# EAGLE design Wrigley V1 (EAGLE 9.6.2)
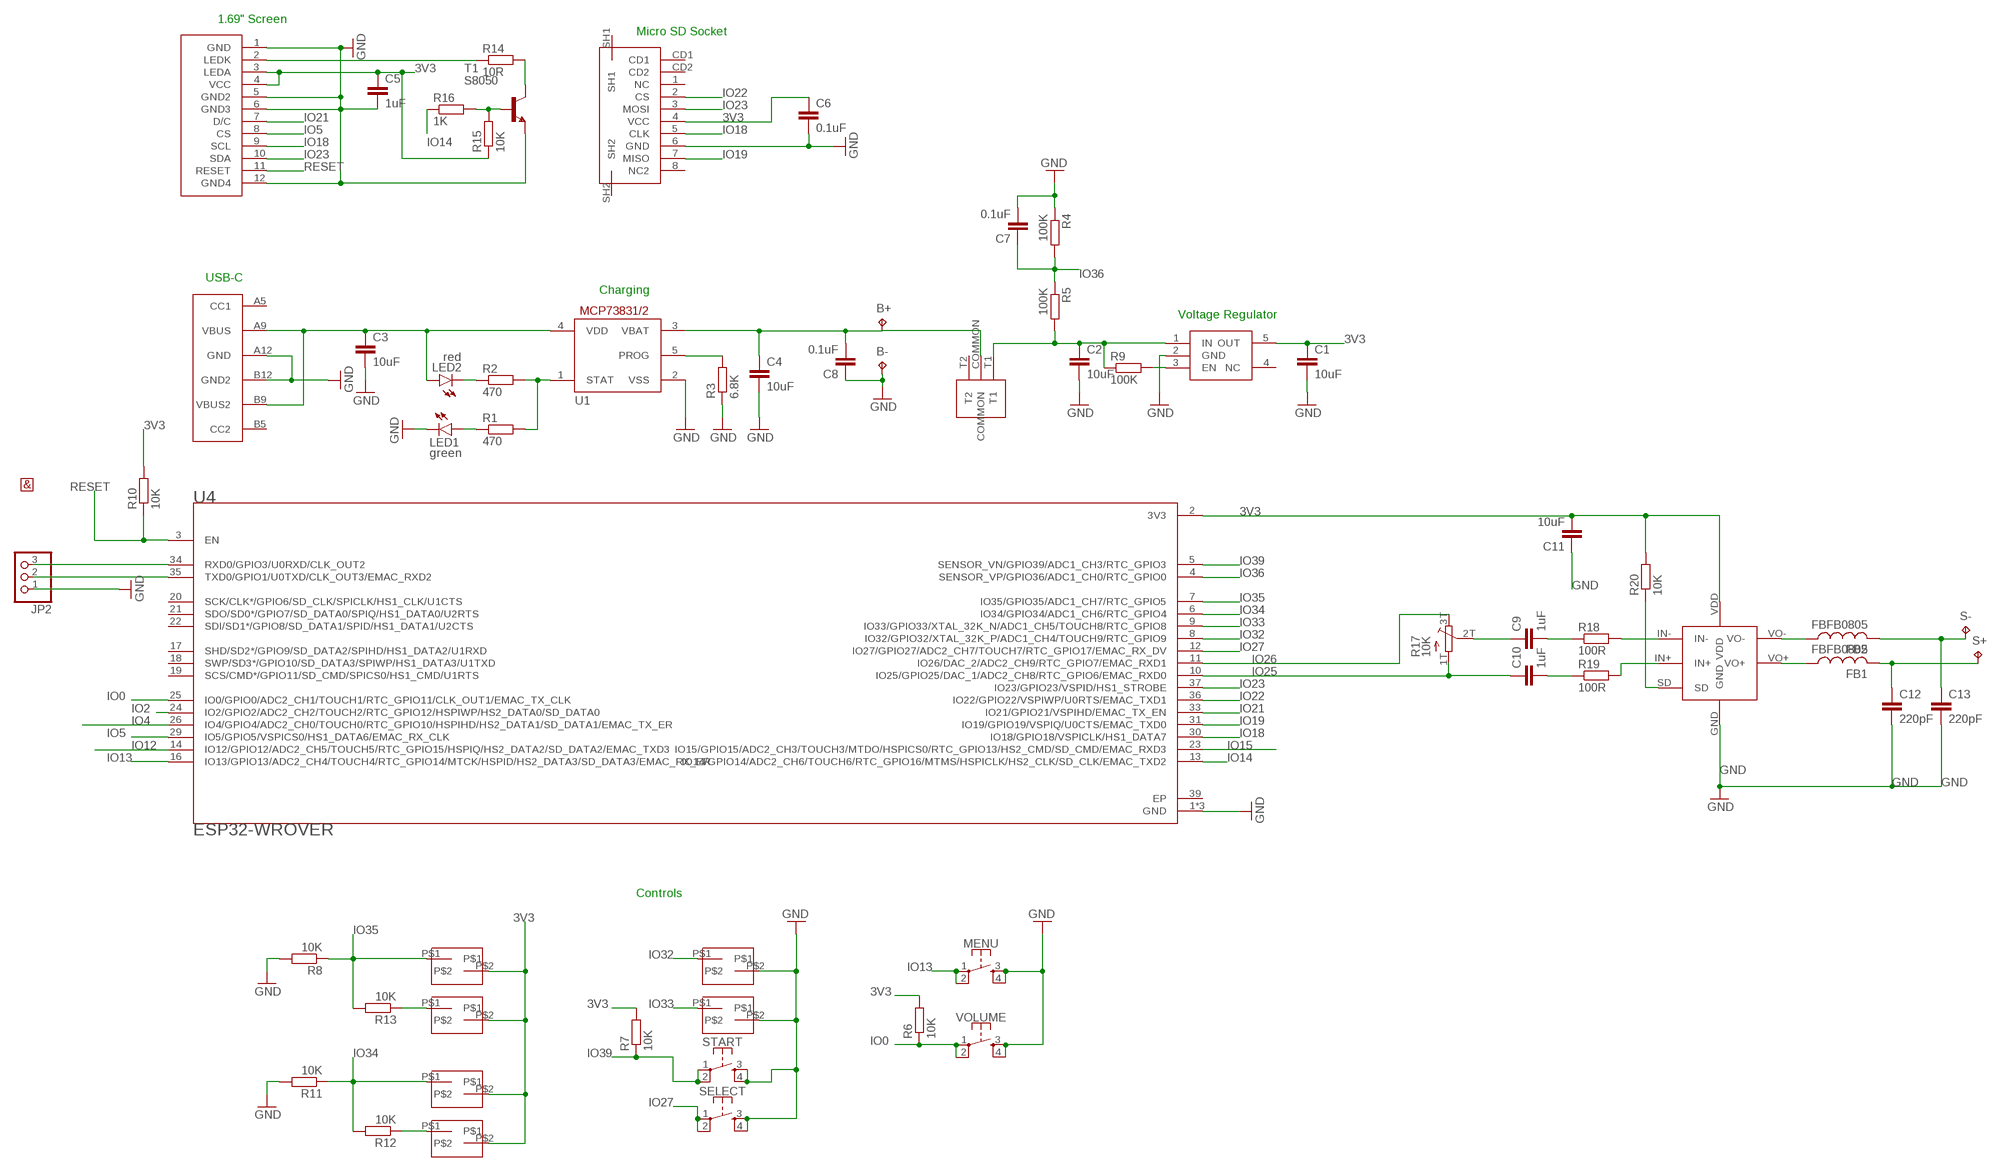
[diagram p0: schematic, sheet 1]

## Parts
A  POCKET-BUTTONS-BIG  [POCKET-MEMBRANE-BIG]
B  POCKET-BUTTONS-BIG  [POCKET-MEMBRANE-BIG]
B+  TPTP20R  [TP20R]
B-  TPTP20R  [TP20R]
C1  10uF  C-EUC0805  [C0805]
C2  10uF  C-EUC0805  [C0805]
C3  10uF  C-EUC0805  [C0805]
C4  10uF  C-EUC0805  [C0805]
C5  1uF  C-EUC0805  [C0805]
C6  0.1uF  C-EUC0805  [C0805]
C7  0.1uF  C-EUC0805  [C0805]
C8  0.1uF  C-EUC0805  [C0805]
C9  1uF  C-EUC0805  [C0805]
C10  1uF  C-EUC0805  [C0805]
C11  10uF  C-EUC0805  [C0805]
C12  220pF  C-EUC0805  [C0805]
C13  220pF  C-EUC0805  [C0805]
DOWN  POCKET-BUTTONS-BIG  [POCKET-MEMBRANE-BIG]
FB1  FBFB0805  [0805]
FB2  FBFB0805  [0805]
JP2  PINHD-1X03_2.54-S  [1X03-S]
LED1  green  LEDCHIP-LED0805  [CHIP-LED0805]
LED2  red  LEDCHIP-LED0805  [CHIP-LED0805]
LEFT  POCKET-BUTTONS-BIG  [POCKET-MEMBRANE-BIG]
MENU  MOMENTARY-SWITCH-SPST-2-SMD-5.2MM  [TACTILE_SWITCH_SMD_5.2MM]
R1  470  R-EU_R0805  [R0805]
R2  470  R-EU_R0805  [R0805]
R3  6.8K  R-EU_R0805  [R0805]
R4  100K  R-EU_M0805  [M0805]
R5  100K  R-EU_M0805  [M0805]
R6  10K  R-EU_M0805  [M0805]
R7  10K  R-EU_M0805  [M0805]
R8  10K  R-EU_M0805  [M0805]
R9  100K  R-EU_M0805  [M0805]
R10  10K  R-EU_M0805  [M0805]
R11  10K  R-EU_M0805  [M0805]
R12  10K  R-EU_M0805  [M0805]
R13  10K  R-EU_M0805  [M0805]
R14  10R  R-EU_M0805  [M0805]
R15  10K  R-EU_M0805  [M0805]
R16  1K  R-EU_M0805  [M0805]
R17  10K  TRIMPOT  [SLIDE-POT-RS08U11AZ001]
R18  100R  R-EU_R0805  [R0805]
R19  100R  R-EU_R0805  [R0805]
R20  10K  R-EU_R0805  [R0805]
RIGHT  POCKET-BUTTONS-BIG  [POCKET-MEMBRANE-BIG]
S+  TPTP20R  [TP20R]
S-  TPTP20R  [TP20R]
SELECT  MOMENTARY-SWITCH-SPST-2-SMD-5.2MM  [TACTILE_SWITCH_SMD_5.2MM]
START  MOMENTARY-SWITCH-SPST-2-SMD-5.2MM  [TACTILE_SWITCH_SMD_5.2MM]
T1  S8050  [SOT23-BEC]
U1  MCP73831/OT  [SOT23-5L]
U2  AP2112-REGULATORWRIGLEY  [SOT23-5L]
U3  PAM8302A  [PAM8302A-SOP8]
U4  ESP32-WROVER  [XCVR-ESP32-WROVER]
U$1  MICROSD-SOCKET-RISTRETTONO-HOLES  [MICROSD-SOCKET-WRIGLEY]
U$3  1.69-INCH-SCREEN-ROUNDED  [1.69-INCH-SCREEN-ROUNDED]
U$5  NULL2-SWITCH  [NULL2-SWITCH]
U$8  USB-C-6PIN  [USB-C-6PIN]
U$9  AMP-HALF  [AMP-HALF]
UP  POCKET-BUTTONS-BIG  [POCKET-MEMBRANE-BIG]
VOLUME  MOMENTARY-SWITCH-SPST-2-SMD-5.2MM  [TACTILE_SWITCH_SMD_5.2MM]

## Nets
3V3: C1.1 C5.1 C6.1 C11.2 DOWN.P$2 LEFT.P$2 R6.2 R7.2 R10.2 R15.1 R20.2 RIGHT.P$2 U2.5(OUT) U3.VDD U4.2(3V3) U$1.4(VCC) U$3.3(LEDA) U$3.4(VCC) UP.P$2
GND: A.P$2 B-.TP B.P$2 C1.2 C2.2 C3.2 C4.2 C5.2 C6.2 C7.2 C8.1 C11.1 C12.2 C13.2 JP2.1 LED1.C MENU.3 MENU.4 R3.1 R4.1 R8.2 R11.2 SELECT.3 SELECT.4 START.3 START.4 T1.E U1.2(VSS) U2.2(GND) U3.GND U4.1(GND) U4.15(GND) U4.38(GND) U$1.6(GND) U$3.1(GND) U$3.5(GND2) U$3.6(GND3) U$3.12(GND4) U$8.A12(GND) U$8.B12(GND2) VOLUME.3 VOLUME.4
IO0: R6.1 U4.25(IO0/GPIO0/ADC2_CH1/TOUCH1/RTC_GPIO11/CLK_OUT1/EMAC_TX_CLK) VOLUME.1 VOLUME.2
IO2: U4.24(IO2/GPIO2/ADC2_CH2/TOUCH2/RTC_GPIO12/HSPIWP/HS2_DATA0/SD_DATA0)
IO4: U4.26(IO4/GPIO4/ADC2_CH0/TOUCH0/RTC_GPIO10/HSPIHD/HS2_DATA1/SD_DATA1/EMAC_TX_ER)
IO5: U4.29(IO5/GPIO5/VSPICS0/HS1_DATA6/EMAC_RX_CLK) U$3.8(CS)
IO12: U4.14(IO12/GPIO12/ADC2_CH5/TOUCH5/RTC_GPIO15/HSPIQ/HS2_DATA2/SD_DATA2/EMAC_TXD3)
IO13: MENU.1 MENU.2 U4.16(IO13/GPIO13/ADC2_CH4/TOUCH4/RTC_GPIO14/MTCK/HSPID/HS2_DATA3/SD_DATA3/EMAC_RX_ER)
IO14: R16.1 U4.13(IO14/GPIO14/ADC2_CH6/TOUCH6/RTC_GPIO16/MTMS/HSPICLK/HS2_CLK/SD_CLK/EMAC_TXD2)
IO15: U4.23(IO15/GPIO15/ADC2_CH3/TOUCH3/MTDO/HSPICS0/RTC_GPIO13/HS2_CMD/SD_CMD/EMAC_RXD3)
IO18: U4.30(IO18/GPIO18/VSPICLK/HS1_DATA7) U$1.5(CLK) U$3.9(SCL)
IO19: U4.31(IO19/GPIO19/VSPIQ/U0CTS/EMAC_TXD0) U$1.7(MISO)
IO21: U4.33(IO21/GPIO21/VSPIHD/EMAC_TX_EN) U$3.7(D/C)
IO22: U4.36(IO22/GPIO22/VSPIWP/U0RTS/EMAC_TXD1) U$1.2(CS)
IO23: U4.37(IO23/GPIO23/VSPID/HS1_STROBE) U$1.3(MOSI) U$3.10(SDA)
IO25: C10.1 R17.1T U4.10(IO25/GPIO25/DAC_1/ADC2_CH8/RTC_GPIO6/EMAC_RXD0)
IO26: R17.3T U4.11(IO26/DAC_2/ADC2_CH9/RTC_GPIO7/EMAC_RXD1)
IO27: SELECT.1 SELECT.2 U4.12(IO27/GPIO27/ADC2_CH7/TOUCH7/RTC_GPIO17/EMAC_RX_DV)
IO32: A.P$1 U4.8(IO32/GPIO32/XTAL_32K_P/ADC1_CH4/TOUCH9/RTC_GPIO9)
IO33: B.P$1 U4.9(IO33/GPIO33/XTAL_32K_N/ADC1_CH5/TOUCH8/RTC_GPIO8)
IO34: LEFT.P$1 R11.1 R12.2 U4.6(IO34/GPIO34/ADC1_CH6/RTC_GPIO4)
IO35: R8.1 R13.2 U4.7(IO35/GPIO35/ADC1_CH7/RTC_GPIO5) UP.P$1
IO36: C7.1 R4.2 R5.1 U4.4(SENSOR_VP/GPIO36/ADC1_CH0/RTC_GPIO0)
IO39: R7.1 START.1 START.2 U4.5(SENSOR_VN/GPIO39/ADC1_CH3/RTC_GPIO3)
N$1: R9.2 U2.3(EN)
N$2: C2.1 R5.2 R9.1 U2.1(IN) U$5.T1
N$3: R3.2 U1.5(PROG)
N$4: R1.2 R2.2 U1.1(STAT)
N$5: LED2.C R2.1
N$6: LED1.A R1.1
N$7: DOWN.P$1 R13.1
N$8: C3.1 LED2.A U1.4(VDD) U$8.A9(VBUS) U$8.B9(VBUS2)
N$9: B+.TP C4.1 C8.2 U1.3(VBAT) U$5.COMMON
N$10: R14.1 U$3.2(LEDK)
N$11: JP2.3 U4.34(RXD0/GPIO3/U0RXD/CLK_OUT2)
N$12: JP2.2 U4.35(TXD0/GPIO1/U0TXD/CLK_OUT3/EMAC_RXD2)
N$13: R14.2 T1.C
N$14: R15.2 R16.2 T1.B
N$15: R12.1 RIGHT.P$1
N$16: C9.1 R17.2T
N$17: C9.2 R18.1
N$18: C10.2 R19.1
N$19: R18.2 U3.IN-
N$20: R19.2 U3.IN+
N$21: C13.1 FB2.2 S-.TP
N$22: C12.1 FB1.2 S+.TP
N$23: FB2.1 U3.VO-
N$24: FB1.1 U3.VO+
N$25: R20.1 U3.SD
RESET: R10.1 U4.3(EN) U$3.11(RESET)
Unconnected: U2.4(NC) U4.17(SHD/SD2*/GPIO9/SD_DATA2/SPIHD/HS1_DATA2/U1RXD) U4.18(SWP/SD3*/GPIO10/SD_DATA3/SPIWP/HS1_DATA3/U1TXD) U4.19(SCS/CMD*/GPIO11/SD_CMD/SPICS0/HS1_CMD/U1RTS) U4.20(SCK/CLK*/GPIO6/SD_CLK/SPICLK/HS1_CLK/U1CTS) U4.21(SDO/SD0*/GPIO7/SD_DATA0/SPIQ/HS1_DATA0/U2RTS) U4.22(SDI/SD1*/GPIO8/SD_DATA1/SPID/HS1_DATA1/U2CTS) U$1.1(NC) U$1.8(NC2) U$1.CD1 U$1.CD2 U$1.SH1 U$1.SH2 U$5.T2 U$8.A5(CC1) U$8.B5(CC2)

## Notes on the sheet
- 1.69" Screen
- Micro SD Socket
- USB-C
- Charging
- Voltage Regulator
- Controls

## Power pins joined to a net without a drawn wire
EP: U4.39(EP)

## Library data of the parts
A B DOWN LEFT RIGHT UP = Ristretto:POCKET-BUTTONS-BIG
B+ B- S+ S- = testpad:TP: Test pad
C1-C13 = rcl:C-EU: CAPACITOR, European symbol; SPICEPREFIX: C
FB1 FB2 = Ristretto:FB: Ferrite bead Digikey #P9821BK-ND
JP2 = Ristretto:PINHD-1X03: PIN HEADER
LED1 LED2 = led:LED: LED OSRAM: - CHIPLED LG R971, LG N971, LY N971, LG Q971, LY Q971, LO R971, LY R971 LH N974, LH R974 LS Q976, LO Q976, LY Q976 LO Q996 - Hyper CHIPLED LW Q18S LB Q993, LB Q99A, LB R99A - SideLED LS A670, LO A670, LY A670, LG A670, LP A670 LB A673, LV A673, LT A673, LW A673 LH A674 LY A675 LS A676, LA A676, LO A676, LY A676, LW A676 LS A679, LY A679, LG A679 - Hyper Micro SIDELED® LS Y876, LA Y876, LO Y876, LY Y876 LT Y87S - SmartLED LW L88C, LW L88S LB L89C, LB L89S, LG L890 LS L89K, LO L89K, LY L89K LS L896, LA L896, LO L896, LY L896 - TOPLED LS T670, LO T670, LY T670, LG T670, LP T670 LSG T670, LSP T670, LSY T670, LOP T670, LYG T670 LG T671, LOG T671, LSG T671 LB T673, LV T673, LT T673, LW T673 LH T674 LS T676, LA T676, LO T676, LY T676, LB T676, LH T676, LSB T676, LW T676 LB T67C, LV T67C, LT T67C, LS T67K, LO T67K, LY T67K, LW E67C LS E67B, LA E67B, LO E67B, LY E67B, LB E67C, LV E67C, LT E67C LW T67C LS T679, LY T679, LG T679 LS T770, LO T770, LY T770, LG T770, LP T770 LB T773, LV T773, LT T773, LW T773 LH T774 LS E675, LA E675, LY E675, LS T675 LS T776, LA T776, LO T776, LY T776, LB T776 LHGB T686 LT T68C, LB T68C - Hyper Mini TOPLED® LB M676 - Mini TOPLED Santana® LG M470 LS M47K, LO M47K, LY M47K Source: http://www.osram.convergy.de LUXEON: - LUMILED® LXK2-PW12-R00, LXK2-PW12-S00, LXK2-PW14-U00, LXK2-PW14-V00 LXK2-PM12-R00, LXK2-PM12-S00, LXK2-PM14-U00 LXK2-PE12-Q00, LXK2-PE12-R00, LXK2-PE12-S00, LXK2-PE14-T00, LXK2-PE14-U00 LXK2-PB12-K00, LXK2-PB12-L00, LXK2-PB12-M00, LXK2-PB14-N00, LXK2-PB14-P00, LXK2-PB14-Q00 LXK2-PR12-L00, LXK2-PR12-M00, LXK2-PR14-Q00, LXK2-PR14-R00 LXK2-PD12-Q00, LXK2-PD12-R00, LXK2-PD12-S00 LXK2-PH12-R00, LXK2-PH12-S00 LXK2-PL12-P00, LXK2-PL12-Q00, LXK2-PL12-R00 Source: www.luxeon.com KINGBRIGHT: KA-3528ASYC Source: www.kingbright.com
MENU SELECT START VOLUME = Ristretto:MOMENTARY-SWITCH-SPST-2: Momentary Switch (Pushbutton) - SPST - Two Circuits Normally-open (NO) SPST momentary switches (buttons, pushbuttons). Schematic symbol includes two switch circuits. Variants SMD-4.6MMX2.8MM - 4.60mm x 2.80mm Tactile Momentary Button Switch - Used on SparkFun SAMD21 Mini Breakout <https://www.sparkfun.com/products/13664> SMD-5.2MM - Mini Pushbutton Switch - SMD <https://www.sparkfun.com/products/8720> - Used on Arduino Pro Mini <https://www.sparkfun.com/products/11114>; PROD_ID: SWCH-08247; SF_SKU: COM-08720
R1-R16 = resistor:R-EU_: RESISTOR, European symbol
R17 = Ristretto:TRIMPOT: SMT trimmer potentiometer part number TC33X http://www.ladyada.net/library/eagle
R18-R20 = rcl:R-EU_: RESISTOR, European symbol; SPICEPREFIX: R
T1 = Ristretto:S8050
U1 = adafruit:MCP73831: MCP73831/2 Miniature Single-Cell, Fully Integrated Li-Ion, Li-Polymer Charge Management Controllers. Nice and small simple lipoly charge controller, with adjustable current and status output (LED) http://www.ladyada.net/library/pcb/eaglelibrary.html
U2 = Ristretto:AP2112-REGULATOR
U3 = Ristretto:PAM8302A
U4 = Ristretto:ESP32-WROVER
U$1 = Ristretto:MICROSD-SOCKET-RISTRETTO
U$3 = Ristretto:1.69-INCH-SCREEN-ROUNDED
U$5 = Ristretto:NULL2-SWITCH
U$8 = ESPkachu:USB-C-6PIN
U$9 = Ristretto:AMP-HALF

## Board
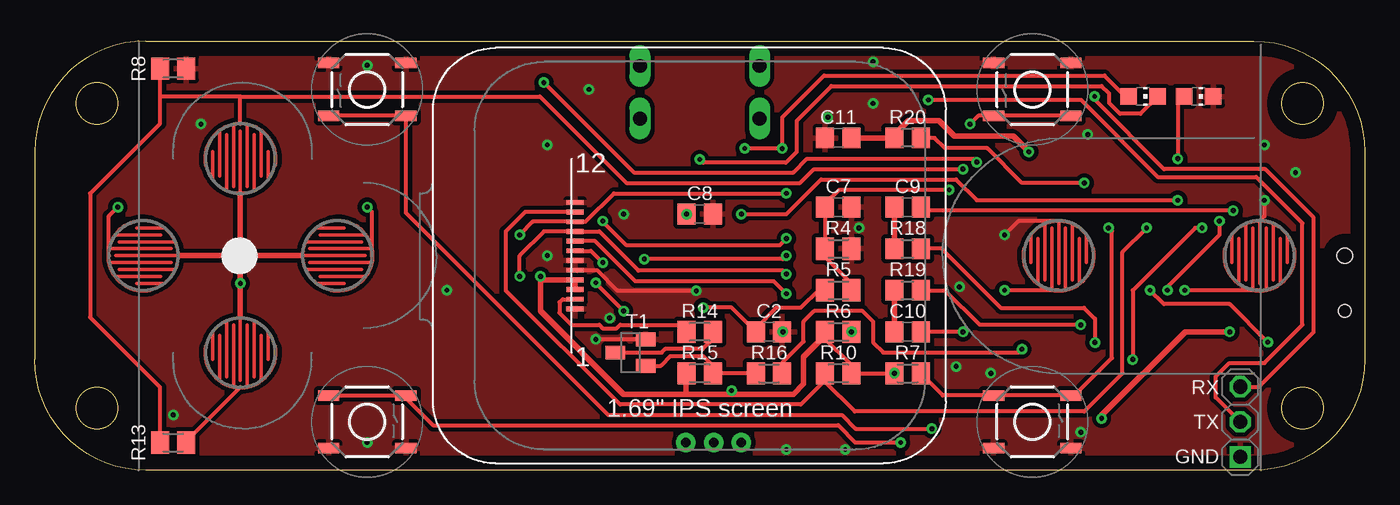
[diagram p1: board, top side]
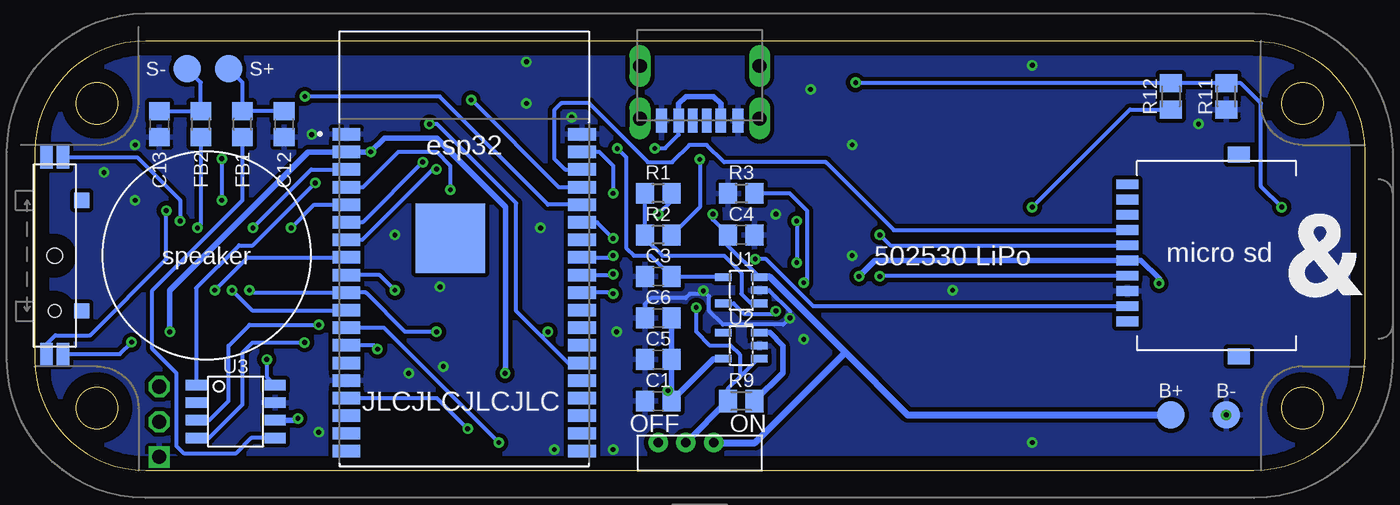
[diagram p2: board, bottom side, seen from below]

Size 96 x 31 mm. Coordinates in mm from the lower left corner, seen from the top.
Outline: 8,31 88,31 arc-90 96,23 96,8 arc-90 88,0 8,0 arc-90 0,8 0,23 arc-90 8,31
Outline: circle at 4.5,4.5 radius 1.5
Outline: circle at 91.5,26.5 radius 1.5
Outline: circle at 4.5,26.5 radius 1.5
Outline: circle at 91.5,4.5 radius 1.5
Copper layers (1*16): Top 0.035mm / dielectric 1.5mm / Bottom 0.035mm
Design rules "default": minimum track width 6mil, minimum drill 0.35mm, track to track 6mil, track to pad 6mil, pad to pad 6mil, via to via 6mil, smd to smd 6mil, copper to edge 40mil, drill to drill 6mil, minimum pad ring 10mil, minimum via ring 8mil, stop-mask expansion 4mil, vias tented up to drill 0mil, thermal gap 10mil

### Footprints (pad centres in the part's own frame; a part is rotated, then mirrored left to right if it is on the bottom)
POCKET-MEMBRANE-BIG = smd 0.305 x 0.152: P$1 0,2.5; P$2 0,-2.5
TP20R = smd 2 x 2: TP 0,0
C0805 = smd 1.3 x 1.5: 1 -0.95,0; 2 0.95,0
0805 = smd 1.3 x 1.5: 1 -0.95,0; 2 0.95,0
1X03-S = drill 1.016 square: 1 -2.54,0 | drill 1.016 octagon: 2 0,0; 3 2.54,0
CHIP-LED0805 = smd 1.2 x 1.2: A 0,-1.05; C 0,1.05
TACTILE_SWITCH_SMD_5.2MM = smd 1.524 x 0.762: 1 -2.794,1.905; 2 2.794,1.905; 3 -2.794,-1.905; 4 2.794,-1.905
R0805 = smd 1.3 x 1.5: 1 -0.95,0; 2 0.95,0
M0805 = smd 1.3 x 1.6: 1 -0.95,0; 2 0.95,0
SLIDE-POT-RS08U11AZ001 = smd 1.6 x 0.9: 1T -7.1,-0.6; 2T -7.1,0.6; 3T 7.1,-0.6; DUMMY 7.1,0.6 | smd 1.1 x 1.1: SH1 -4,-1.95; SH2 4,-1.95 | hole 1.1: 0,0 | hole 0.9: -4,0
SOT23-BEC = smd 1 x 1.4: B -0.95,-1.1; C 0,1.1; E 0.95,-1.1
SOT23-5L = smd 0.55 x 1.2: 1 -0.95,-1.3; 2 0,-1.3; 3 0.95,-1.3; 4 0.95,1.3; 5 -0.95,1.3
PAM8302A-SOP8 = smd 0.75 x 1.5: GND -0.637,2.85; IN+ 0.637,-2.85; IN- 1.913,-2.85; NC -0.637,-2.85; SD -1.913,-2.85; VDD 0.637,2.85; VO+ 1.913,2.85; VO- -1.913,2.85
XCVR-ESP32-WROVER = smd 2 x 0.9: 1 -8.5,8.26; 2 -8.5,6.99; 3 -8.5,5.72; 4 -8.5,4.45; 5 -8.5,3.18; 6 -8.5,1.91; 7 -8.5,0.64; 8 -8.5,-0.63; 9 -8.5,-1.9; 10 -8.5,-3.17; 11 -8.5,-4.44; 12 -8.5,-5.71; 13 -8.5,-6.98; 14 -8.5,-8.25; 15 -8.5,-9.52; 16 -8.5,-10.79; 17 -8.5,-12.06; 18 -8.5,-13.33; 19 -8.5,-14.6; 20 8.5,-14.6; 21 8.5,-13.33; 22 8.5,-12.06; 23 8.5,-10.79; 24 8.5,-9.52; 25 8.5,-8.25; 26 8.5,-6.98; 27 8.5,-5.71; 28 8.5,-4.44; 29 8.5,-3.17; 30 8.5,-1.9; 31 8.5,-0.63; 32 8.5,0.64; 33 8.5,1.91; 34 8.5,3.18; 35 8.5,4.45; 36 8.5,5.72; 37 8.5,6.99; 38 8.5,8.26 | smd 5 x 5: 39 -1,0.76
MICROSD-SOCKET-WRIGLEY = smd 0.7 x 1.6: 1 -2.95,-3.15; 2 -1.85,-3.15; 3 -0.75,-3.15; 4 0.35,-3.15; 5 1.45,-3.15; 6 2.55,-3.15; 7 3.65,-3.15; 8 4.75,-3.15; CD1 -5.15,-3.15; CD2 -4.05,-3.15 | smd 1.15 x 1.6: SH1 -7.29,4.9; SH2 7.29,4.9
1.69-INCH-SCREEN-ROUNDED = smd 1.2 x 0.35: 1 -9,-3.85; 2 -9,-3.15; 3 -9,-2.45; 4 -9,-1.75; 5 -9,-1.05; 6 -9,-0.35; 7 -9,0.35; 8 -9,1.05; 9 -9,1.75; 10 -9,2.45; 11 -9,3.15; 12 -9,3.85
NULL2-SWITCH = drill 0.7 pad 1.422: COMMON 3.5,0.5; T1 5.5,0.5; T2 7.5,0.5
USB-C-6PIN = smd 0.7 x 1.7: A5 -0.5,0; B5 0.5,0 | smd 0.76 x 1.7: A9 1.52,0; B9 -1.52,0 | smd 0.8 x 1.7: A12 2.75,0; B12 -2.75,0 | drill 1 pad 1.016 long: P$7 4.32,-0.15; P$8 -4.32,-0.15; P$9 4.32,-3.95; P$10 -4.32,-3.95

### Placement (x,y rotation side)
A  88.4,15.5 180 top
B  73.9,15.5 180 top
B+  14,4 0 bottom
B-  10,4 0 bottom
C1  51,5 180 bottom
C2  53,10 0 top
C3  51,14 180 bottom
C4  45,17 0 bottom
C5  51,8 180 bottom
C6  51,11 180 bottom
C7  58,19 0 top
C8  48,18.5 180 top
C9  63,19 180 top
C10  63,10 180 top
C11  58,24 0 top
C12  78,25 270 bottom
C13  87,25 270 bottom
DOWN  14.85,8.5 180 top
FB1  81,25 90 bottom
FB2  84,25 90 bottom
JP2  87,3.5 90 top
LED1  84,27 270 top
LED2  80,27 270 top
LEFT  7.85,15.5 90 top
MENU  24,27.5 180 top
R1  51,20 180 bottom
R2  51,17 180 bottom
R3  45,20 0 bottom
R4  58,16 180 top
R5  58,13 180 top
R6  58,10 180 top
R7  63,7 180 top
R8  10,29 0 top
R9  45,5 0 bottom
R10  58,7 0 top
R11  10,27 270 bottom
R12  14,27 90 bottom
R13  10,2 180 top
R14  48,10 0 top
R15  48,7 0 top
R16  53,7 180 top
R17  94.55,15.5 90 bottom
R18  63,16 0 top
R19  63,13 0 top
R20  63,24 180 top
RIGHT  21.85,15.5 270 top
S+  82,29 0 bottom
S-  85,29 0 bottom
SELECT  24,3.5 0 top
START  72,3.5 0 top
T1  43,8.5 90 top
U1  45,13 90 bottom
U2  45,9 90 bottom
U3  81.5,4.25 270 bottom
U4  65,16 0 bottom
U$1  14,15.5 270 bottom
U$3  48,15.5 0 top
U$5  43.5,2.5 180 bottom
U$8  48,25.25 180 bottom
U$9  5.5,12.5 0 bottom
UP  14.85,22.5 0 top
VOLUME  72,27.5 180 top

### Tracks (layer width: path | path; a pad name or v marks a point on that pad's centre or on a via)
3V3  (via drill 0.35)
  Top 0.305: UP.P$2 14.85,15.5 | 14.85,15.5 v14.85,13.5 DOWN.P$2 | R6.2 57.05,9.5 58.95,7.6 R10.2 R7.2 | RIGHT.P$2 14.85,15.5 | LEFT.P$2 14.85,15.5
  Top 0.406: C11.2 R20.2 62.05,24.25 63.05,25.25 65.25,25.25 66.38,24.12 70.62,24.12 v71.75,23 | U$3.3 U$3.4 36.75,13.75 v36.5,14 36.5,11.5 42.5,5.5 47,5.5 | DOWN.P$2 UP.P$2 | LEFT.P$2 RIGHT.P$2 | R6.2 57.05,9.75 55.5,8.2 55.5,6.25 54.75,5.5 50,5.5 | 50,5.5 47,5.5 | R15.1 47,6.95 47,5.5 | 50,5.5 50.25,5.75 v50.3,5.75 | v77,3.75 77,3.96 83.05,10 v86.25,10
  Bottom 0.406: C6.1 C5.1 50.05,5.75 v50.3,5.75 50.3,5.25 C1.1 47,8.05 U2.5 | R7.2 62,7.05 62,11.53 62.01,11.54 62.01,19.01 67,24 70.75,24 v71.75,23 v71.76,22.99 U4.2 76.26,22.99 86.25,13 v86.25,10 | v36.5,14 35.35,15.15 U$1.4 16.15,15.15 14.85,13.85 v14.85,13.5 | U3.VDD 77.14,3.61 v77,3.75
  other vias: 62.05,7
GND  (via drill 0.35)
  Top 0.305: A.P$2 88.75,18.35 v88.75,19.5 | v70,17 71,18 B.P$2 | U$3.5 40.58,14.45 42.03,13 47.71,13 v47.75,12.96 | T1.E 40.51,9.45 v40.5,9.46
  Bottom 0.305: U1.2 43,13 41.5,11.5 v41.5,11 41.97,10.53 44.93,10.53 46.34,10.53 47.32,11.51 47.32,12.57 47.5,12.75 48.72,12.75 49.02,12.45 51.51,12.45 51.95,12 C6.2
  other vias: 10,4 24,2 12,25 24,29.25 37,15.5 37,23.5 40,27.5 54,10 42.5,18.5 91,21.5 75.5,2.75 88.75,23.5 69,7 66.5,7.5 66.75,13.25 76,24.25 29.75,13 57.25,25.5 60.5,26.5 60.5,29.5 58.5,1.5 54.25,1.5 59.5,17.5
  pour Top (isolate 0.305): 97,-1 -1,-1 -1,32 97,32
  pour Bottom (isolate 0.305): 98,-2 -2,-2 -2,33 98,33
IO0  (via drill 0.35)
  Top 0.305: VOLUME.1 VOLUME.2 68.09,25.59 v67.5,25
  Bottom 0.305: 59.38,9.62 61.25,11.5 61.25,19.29 66.96,25 v67.5,25 | R6.1 59,10 59.38,9.62 | U4.25 57.5,7.75 59.38,9.62
  other vias: 58.95,10
IO5  (via drill 0.35)
  Top 0.305: v54.25,12.75 53.35,13.64 43.35,13.64 40.45,16.55 U$3.8
  Bottom 0.305: v54.25,12.75 54.33,12.83 U4.29
IO13  (via drill 0.35)
  Top 0.305: MENU.2 MENU.1 26.79,18.59 41.39,4 58.25,4 59.25,3 v64.75,3
  Bottom 0.305: U4.16 66.96,5.21 v64.75,3
IO14  (via drill 0.35)
  Top 0.305: v71.25,8.75 71,8.5 61.25,8.5 60.5,9.25 60.5,10.75 59.75,11.5 56.25,11.5 55.5,10.75 55.5,9.3 53.95,7.75 R16.1
  Bottom 0.305: v71.25,8.75 71.52,9.02 U4.13
IO18  (via drill 0.35)
  Top 0.305: v54.25,14.17 54,14.42 43.58,14.42 40.75,17.25 U$3.9 36.75,17.25 35,15.5 v35,14
  Bottom 0.305: v35,14 34.95,14.05 U$1.5 | v54.25,14.17 54.32,14.1 U4.30
IO19  (via drill 0.35)
  Top 0.305: v54.25,15.5 54,15.25 v44,15.25
  Bottom 0.305: v54.25,15.5 54.38,15.37 U4.31 | v44,15.25 43.21,15.25 39.81,11.85 U$1.7
IO21  (via drill 0.35)
  Top 0.305: v41,15 40.15,15.85 U$3.7 | v54.25,16.75 53.75,16.25 42.72,16.25 41,17.97 v41,18
  Bottom 0.305: v41,18 v41,15 | v54.25,16.75 55.41,17.91 U4.33
IO22
  Bottom 0.305: U$1.2 34,17.35 38.9,22.25 46.25,22.25 47.5,23.5 48.75,23.5 50,22.25 51.75,22.25 56,26.5 58,26.5 58.5,26 58.5,22.5 57.72,21.72 U4.36
IO23  (via drill 0.35)
  Top 0.305: v35,17 35.95,17.95 U$3.10 39.75,17.95 41.8,20 v54.25,20
  Bottom 0.305: v35,17 34.25,16.25 U$1.3 | v54.25,20 54.25,22 55.24,22.99 U4.37
IO25  (via drill 0.35)
  Top 0.305: v67,10 C10.1 | v89,9.25 86.25,12 81.5,12 v80.5,13
  Bottom 0.305: v67,10 69.25,10 72.08,12.83 U4.10 80.33,12.83 v80.5,13 | R17.1T 89.85,8.4 v89,9.25
IO26  (via drill 0.35)
  Top 0.305: v85.5,18 85.5,17 81.75,13.25 v81.75,13
  Bottom 0.305: R17.3T 88.6,22.6 85.5,19.5 v85.5,18 | U4.11 80.31,11.56 v81.75,13
IO27  (via drill 0.35)
  Top 0.305: SELECT.1 SELECT.2 | 26.79,5.21 28.75,3.25 58,3.25 59.25,2 v62.5,2
  Top 0.406: SELECT.2 26.79,5.21
  Bottom 0.305: U4.12 70.79,10.29 v62.5,2
IO32  (via drill 0.35)
  Top 0.305: A.P$1 v83,13
  Bottom 0.305: v83,13 80.63,15.37 U4.8
IO33  (via drill 0.35)
  Top 0.305: B.P$1 v70,13
  Bottom 0.305: v70,13 71.1,14.1 U4.9
IO34  (via drill 0.35)
  Top 0.305: LEFT.P$1 5.35,18.35 v6,19 | v36.75,28 43.25,21.5 54.75,21.5 55.75,22.5 67.75,22.5 v68,22.25
  Bottom 0.305: v36.75,28 36.7,27.95 R12.2 R11.1 8.95,27.95 7.5,26.5 7.5,20.5 v6,19 | U4.6 72.34,17.91 v68,22.25
IO35  (via drill 0.35)
  Top 0.305: R13.2 9.05,6 4,11.05 4,20 9.05,25.05 9.05,27 | UP.P$1 14.85,27 | 14.85,27 36.46,27 42.71,20.75 55.25,20.75 56.25,21.75 v67,21.75 | 9.05,27 9.05,28.9 | 14.85,27 9.05,27
  Top 0.406: R8.1 9,28.95 9.05,28.9
  Bottom 0.305: U4.7 72.36,16.64 67.25,21.75 v67,21.75
IO36  (via drill 0.35)
  Top 0.305: v66,20.25 58.05,20.25 57.05,19.25 C7.1 R4.2 57.05,15.4 58.95,13.5 R5.1
  Bottom 0.305: U4.4 72.3,20.45 69.75,23 67,23 66,22 v66,20.25
IO39  (via drill 0.35)
  Top 0.305: R7.1 65.55,5.41 START.1 START.2 75.04,5.41 77.75,8.11 77.75,17.25 v77.5,17.5
  Bottom 0.305: v77.5,17.5 75.82,19.18 U4.5
N$1
  Bottom 0.406: R9.2 42,7.05 42,9 42.95,9.95 U2.3
N$2  (via drill 0.35)
  Top 0.305: R5.2 56.55,13 55.3,11.75 53.55,11.75 52.05,10.25 C2.1 50.3,11.75 v48.25,11.75
  Bottom 0.305: 45.1,6.74 45.1,8.36 45.75,9 47.25,9 48.25,10 v48.25,11.75 | R9.1 45.95,5.9 45.1,6.74 | 43.8,8.05 45.1,6.74
  Bottom 0.406: R9.1 46,5 U$5.T1 | U2.1 43.8,8.05
N$3  (via drill 0.35)
  Top 0.305: v42.5,11.5 40.5,13.5 v40.5,13.55
  Bottom 0.305: v42.5,11.5 42.7,11.3 44.8,11.3 45.55,12.05 U1.5 | R3.2 41.5,20 40.25,18.75 40.25,13.75 v40.5,13.55
N$4
  Bottom 0.305: R1.2 R2.2 51.95,16.75 50.7,15.5 46.25,15.5 45,14.25 45,12.75 44.3,12.05 U1.1
N$5  (via drill 0.35)
  Top 0.305: v48,22.46 48.25,22.21 54.21,22.21 55,23 55,25.25 57.5,27.75 77,27.75 77.55,27.2 77.55,26.52 78.32,25.75 79.8,25.75 LED2.C
  Bottom 0.305: v48,22.46 48,19 50,17 R2.1
N$6  (via drill 0.35)
  Top 0.305: v51,18.5 54.25,18.5 56.75,21 66.5,21 68,19.5 v82.5,19.5 | LED1.A 82.95,26.95 82.5,26.5 v82.5,22.5
  Bottom 0.305: R1.1 50.05,19.45 v51,18.5 | v82.5,22.5 v82.5,19.5
N$7
  Top 0.305: DOWN.P$1 10.95,2.1
  Top 0.406: 10.95,2.1 R13.1
N$8  (via drill 0.35)
  Top 0.305: v51.25,23.25 51.25,23.23 v53.95,23.23 53.95,25.48 56.97,28.5 77.2,28.5 78.7,27 LED2.A
  Bottom 0.305: C3.1 51.55,15.5 52.75,15.5 53.32,16.07 53.32,22.6 v53.95,23.23 | v51.25,23.25 50.5,23.25 49.52,24.23 U$8.A9 | U1.4 50,13.95
  Bottom 0.406: 50,13.95 C3.1 | U$8.B9 46.48,26.48 47,27 49,27 49.52,26.48 U$8.A9
N$9  (via drill 0.35)
  Bottom 0.305: U1.3 46,16.25 46,17 C4.1 47.05,18.1 C8.2
  Bottom 0.508: B+.TP 33,4 37.5,8.5 | U$5.COMMON 44,2 37.5,8.5 | 37.5,8.5 42.95,13.95 U1.3
  other vias: 47.05,18.5
N$10
  Top 0.305: R14.1 46.55,10.5 42.25,10.5 42,10.25 41,10.25 40.75,10.5 38.75,10.5 37.88,11.38 37.88,12.12 38.1,12.35 U$3.2
N$11  (via drill 0.35)
  Top 0.305: v76.5,27 76.5,26.75 81.5,21.75 88.81,21.75 92.31,18.25 92.31,10 88.65,6.35 88.35,6.04 JP2.3
  Bottom 0.305: U4.34 58.95,19.18 66.77,27 v76.5,27
N$12  (via drill 0.35)
  Top 0.305: v64.5,26.75 64.51,26.76 75.49,26.76 81.06,21.19 88.16,21.19 91.5,17.85 91.5,10.5 88.75,7.75 86.22,7.75 85.23,6.77 85.23,5.27 JP2.2
  Bottom 0.305: v64.5,26.75 64.48,26.75 58.18,20.45 U4.35
N$13
  Top 0.305: T1.C 45.25,8.5 45.5,8.75 48.2,8.75 48.95,9.5 R14.2
N$14
  Top 0.305: R16.2 R15.2 48.95,7.55 48.25,8.25 45.9,8.25 45.2,7.55 T1.B
N$15  (via drill 0.35)
  Top 0.305: RIGHT.P$1 24.35,18.65 v24,19
  Bottom 0.305: v24,19 16.95,26.05 R12.1
N$16  (via drill 0.35)
  Top 0.305: C9.1 64.2,18.75 v86.5,18.75
  Bottom 0.305: R17.2T 95.15,9.1 94.5,9.75 92,9.75 86.5,15.25 v86.5,18.75
N$17
  Top 0.406: C9.2 R18.1
N$18
  Top 0.406: R19.1 C10.2
N$19  (via drill 0.35)
  Top 0.305: R18.2 65.45,16 69.72,11.73 75.73,11.73 76.52,10.94 v76.52,9.23
  Bottom 0.305: U3.IN- 83.41,2.34 81,4.75 81,8.5 80.27,9.23 v76.52,9.23
N$20  (via drill 0.35)
  Top 0.305: v75.5,10.5 68.2,10.5 65.7,13 R19.2
  Bottom 0.305: v75.5,10.5 80.5,10.5 82,9 82,5 83.39,3.61 U3.IN+
N$21
  Bottom 0.305: C13.1 FB2.2 84,28 S-.TP
N$22
  Bottom 0.305: C12.1 FB1.2 81,28 S+.TP
N$23  (via drill 0.35)
  Top 0.305: v84.25,17.5 83.75,17.5 79.25,13 v79.25,8
  Bottom 0.305: FB2.1 84,17.8 84.25,17.55 v84.25,17.5 | v79.25,8 79.25,6.76 U3.VO-
N$24
  Bottom 0.305: FB1.1 81,19.5 87.5,13 87.5,8.75 85.75,7 85.75,1.75 85.21,1.21 81.5,1.21 80.37,2.34 U3.VO+
N$25  (via drill 0.35)
  Top 0.305: v75.75,20.75 71.25,20.75 68.75,23.25 65.7,23.25 64.95,24 R20.1
  Bottom 0.305: v75.75,20.75 80.25,16.25 81.25,16.25 84.35,13.15 U3.SD
RESET  (via drill 0.35)
  Top 0.305: v80.25,17.5 78.5,15.75 78.5,7 75.75,4.25 59.2,4.25 57.05,6.4 R10.1 57.05,6.5 55.3,4.75 42.25,4.75 34,13 34,17.25 35.4,18.65 U$3.11
  Bottom 0.305: v80.25,17.5 76.03,21.72 U4.3

### Text on the board
tPlace: RX | 1.69" IPS screen | TX | GND
bPlace: esp32 | micro sd | 502530 LiPo | speaker | U3 | JLCJLCJLCJLC | ON | OFF
tStop: system | options | select | start